# Altium schematic sheet ram.schdoc: RAM
size A4; Date: 10.25.2025; CheckedBy: BCY; DrawnBy: miaow; DocumentNumber: 3; Revision: v1.0.0; SheetNumber: 3; SheetTotal: 14; BoardType: MAIN_PCB; Desc: SDRAM for mcu
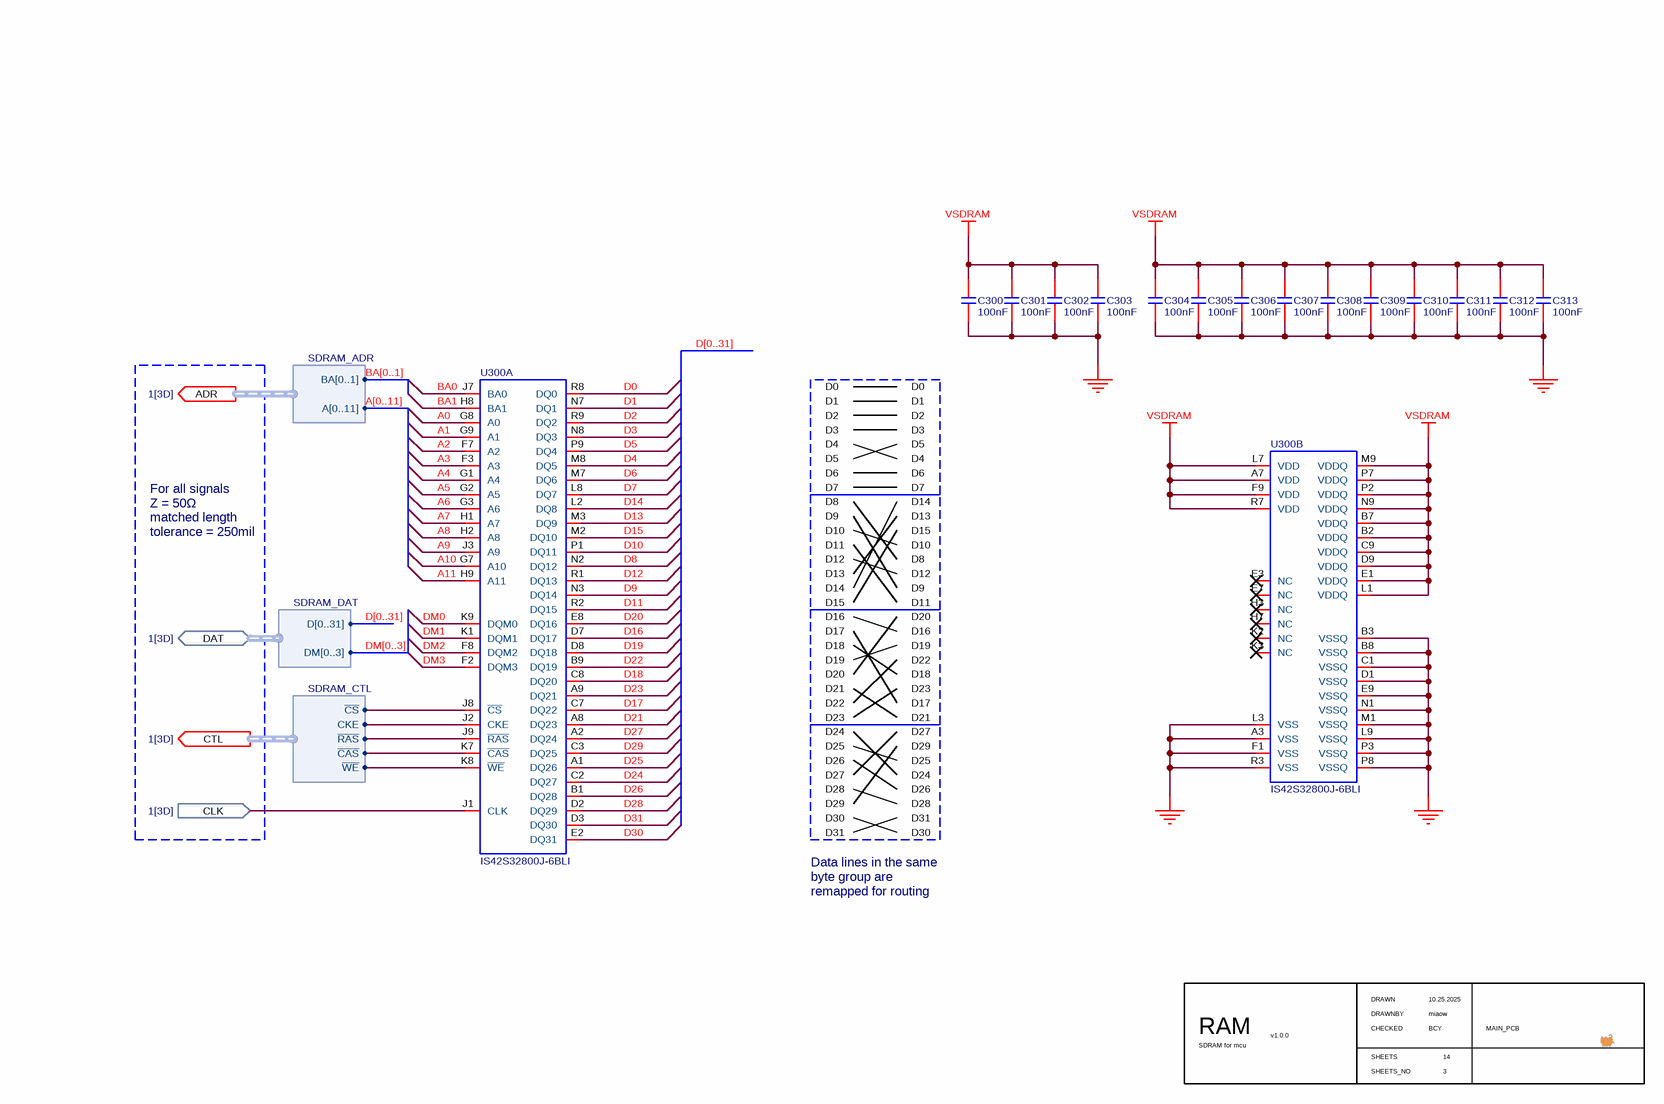
[diagram p0: ram.schdoc]

## Parts
C300  value 100nF  [C0402]  (hidden comment: C-NOMO)
C301  value 100nF  [C0402]  (hidden comment: C-NOMO)
C302  value 100nF  [C0402]  (hidden comment: C-NOMO)
C303  value 100nF  [C0402]  (hidden comment: C-NOMO)
C304  value 100nF  [C0402]  (hidden comment: C-NOMO)
C305  value 100nF  [C0402]  (hidden comment: C-NOMO)
C306  value 100nF  [C0402]  (hidden comment: C-NOMO)
C307  value 100nF  [C0402]  (hidden comment: C-NOMO)
C308  value 100nF  [C0402]  (hidden comment: C-NOMO)
C309  value 100nF  [C0402]  (hidden comment: C-NOMO)
C310  value 100nF  [C0402]  (hidden comment: C-NOMO)
C311  value 100nF  [C0402]  (hidden comment: C-NOMO)
C312  value 100nF  [C0402]  (hidden comment: C-NOMO)
C313  value 100nF  [C0402]  (hidden comment: C-NOMO)
U300  IS42S32800J-6BLI  [IS42S32800J-6BLI]  (parts A,B of 2)

## Ports
ADR (out, harness SDRAM_ADR, see 1[3D]), CLK (in, see 1[3D]), CTL (out, harness SDRAM_CTL, see 1[3D]), DAT (bidir, harness SDRAM_DAT, see 1[3D])

## Harnesses
SDRAM_CTL: ~{CS}, CKE, ~{RAS}, ~{CAS}, ~{WE}
SDRAM_ADR: BA[0..1], A[0..11]
SDRAM_DAT: DM[0..3], D[0..31]

## Nets
GND: C300.1 C301.1 C302.1 C303.1 C304.1 C305.1 C306.1 C307.1 C308.1 C309.1 C310.1 C311.1 C312.1 C313.1 U300.A3(VSS) U300.B3(VSSQ) U300.B8(VSSQ) U300.C1(VSSQ) U300.D1(VSSQ) U300.E9(VSSQ) U300.F1(VSS) U300.L3(VSS) U300.L9(VSSQ) U300.M1(VSSQ) U300.N1(VSSQ) U300.P3(VSSQ) U300.P8(VSSQ) U300.R3(VSS)
VSDRAM: C300.2 C301.2 C302.2 C303.2 C304.2 C305.2 C306.2 C307.2 C308.2 C309.2 C310.2 C311.2 C312.2 C313.2 U300.A7(VDD) U300.B2(VDDQ) U300.B7(VDDQ) U300.C9(VDDQ) U300.D9(VDDQ) U300.E1(VDDQ) U300.F9(VDD) U300.L1(VDDQ) U300.L7(VDD) U300.M9(VDDQ) U300.N9(VDDQ) U300.P2(VDDQ) U300.P7(VDDQ) U300.R7(VDD)
A0: U300.G8(A0)
A1: U300.G9(A1)
A2: U300.F7(A2)
A3: U300.F3(A3)
A4: U300.G1(A4)
A5: U300.G2(A5)
A6: U300.G3(A6)
A7: U300.H1(A7)
A8: U300.H2(A8)
A9: U300.J3(A9)
A10: U300.G7(A10)
A11: U300.H9(A11)
BA0: U300.J7(BA0)
BA1: U300.H8(BA1)
CLK: U300.J1(CLK) ; port CLK
D0: U300.R8(DQ0)
D1: U300.N7(DQ1)
D2: U300.R9(DQ2)
D3: U300.N8(DQ3)
D4: U300.M8(DQ5)
D5: U300.P9(DQ4)
D6: U300.M7(DQ6)
D7: U300.L8(DQ7)
D8: U300.N2(DQ12)
D9: U300.N3(DQ14)
D10: U300.P1(DQ11)
D11: U300.R2(DQ15)
D12: U300.R1(DQ13)
D13: U300.M3(DQ9)
D14: U300.L2(DQ8)
D15: U300.M2(DQ10)
D16: U300.D7(DQ17)
D17: U300.C7(DQ22)
D18: U300.C8(DQ20)
D19: U300.D8(DQ18)
D20: U300.E8(DQ16)
D21: U300.A8(DQ23)
D22: U300.B9(DQ19)
D23: U300.A9(DQ21)
D24: U300.C2(DQ27)
D25: U300.A1(DQ26)
D26: U300.B1(DQ28)
D27: U300.A2(DQ24)
D28: U300.D2(DQ29)
D29: U300.C3(DQ25)
D30: U300.E2(DQ31)
D31: U300.D3(DQ30)
DM0: U300.K9(DQM0)
DM1: U300.K1(DQM1)
DM2: U300.F8(DQM2)
DM3: U300.F2(DQM3)
NetU300_J2: U300.J2(CKE) ; port CTL.CKE
NetU300_J8: U300.J8(~{CS}) ; port CTL.~{CS}
NetU300_J9: U300.J9(~{RAS}) ; port CTL.~{RAS}
NetU300_K7: U300.K7(~{CAS}) ; port CTL.~{CAS}
NetU300_K8: U300.K8(~{WE}) ; port CTL.~{WE}

Not connected (* = marked no-connect by the designer): U300 E3(NC)* E7(NC)* H3(NC)* H7(NC)* K2(NC)* K3(NC)*

## Buses and harness runs
bus A[0..11]
bus BA[0..1]
bus D[0..31]
bus DM[0..3]

## Notes on the sheet
- D0
- D1
- D2
- D3
- D4
- D5
- D6
- D7
- D8
- D9
- D10
- D11
- D14
- D15
- D13
- For all signals
  Z = 50Ω
  matched length tolerance = 250mil
- D12
- D16
- D20
- D17
- D18
- D19
- D21
- D23
- D22
- D24
- D25
- D26
- D27
- D29
- D28
- D30
- D31
- Data lines in the same byte group are remapped for routing
- DRAWN
- CHECKED
- DRAWNBY
- SHEETS
- SHEETS_NO

## Library data of the parts
C300-C313 = C-NOMO: voltage: 25V; precision: 5%
U300 = IS42S32800J-6BLI: Supplier 1: LCSC; Supplier Part Number 1: C1351419